# Altium project FPPZ.PrjPcb
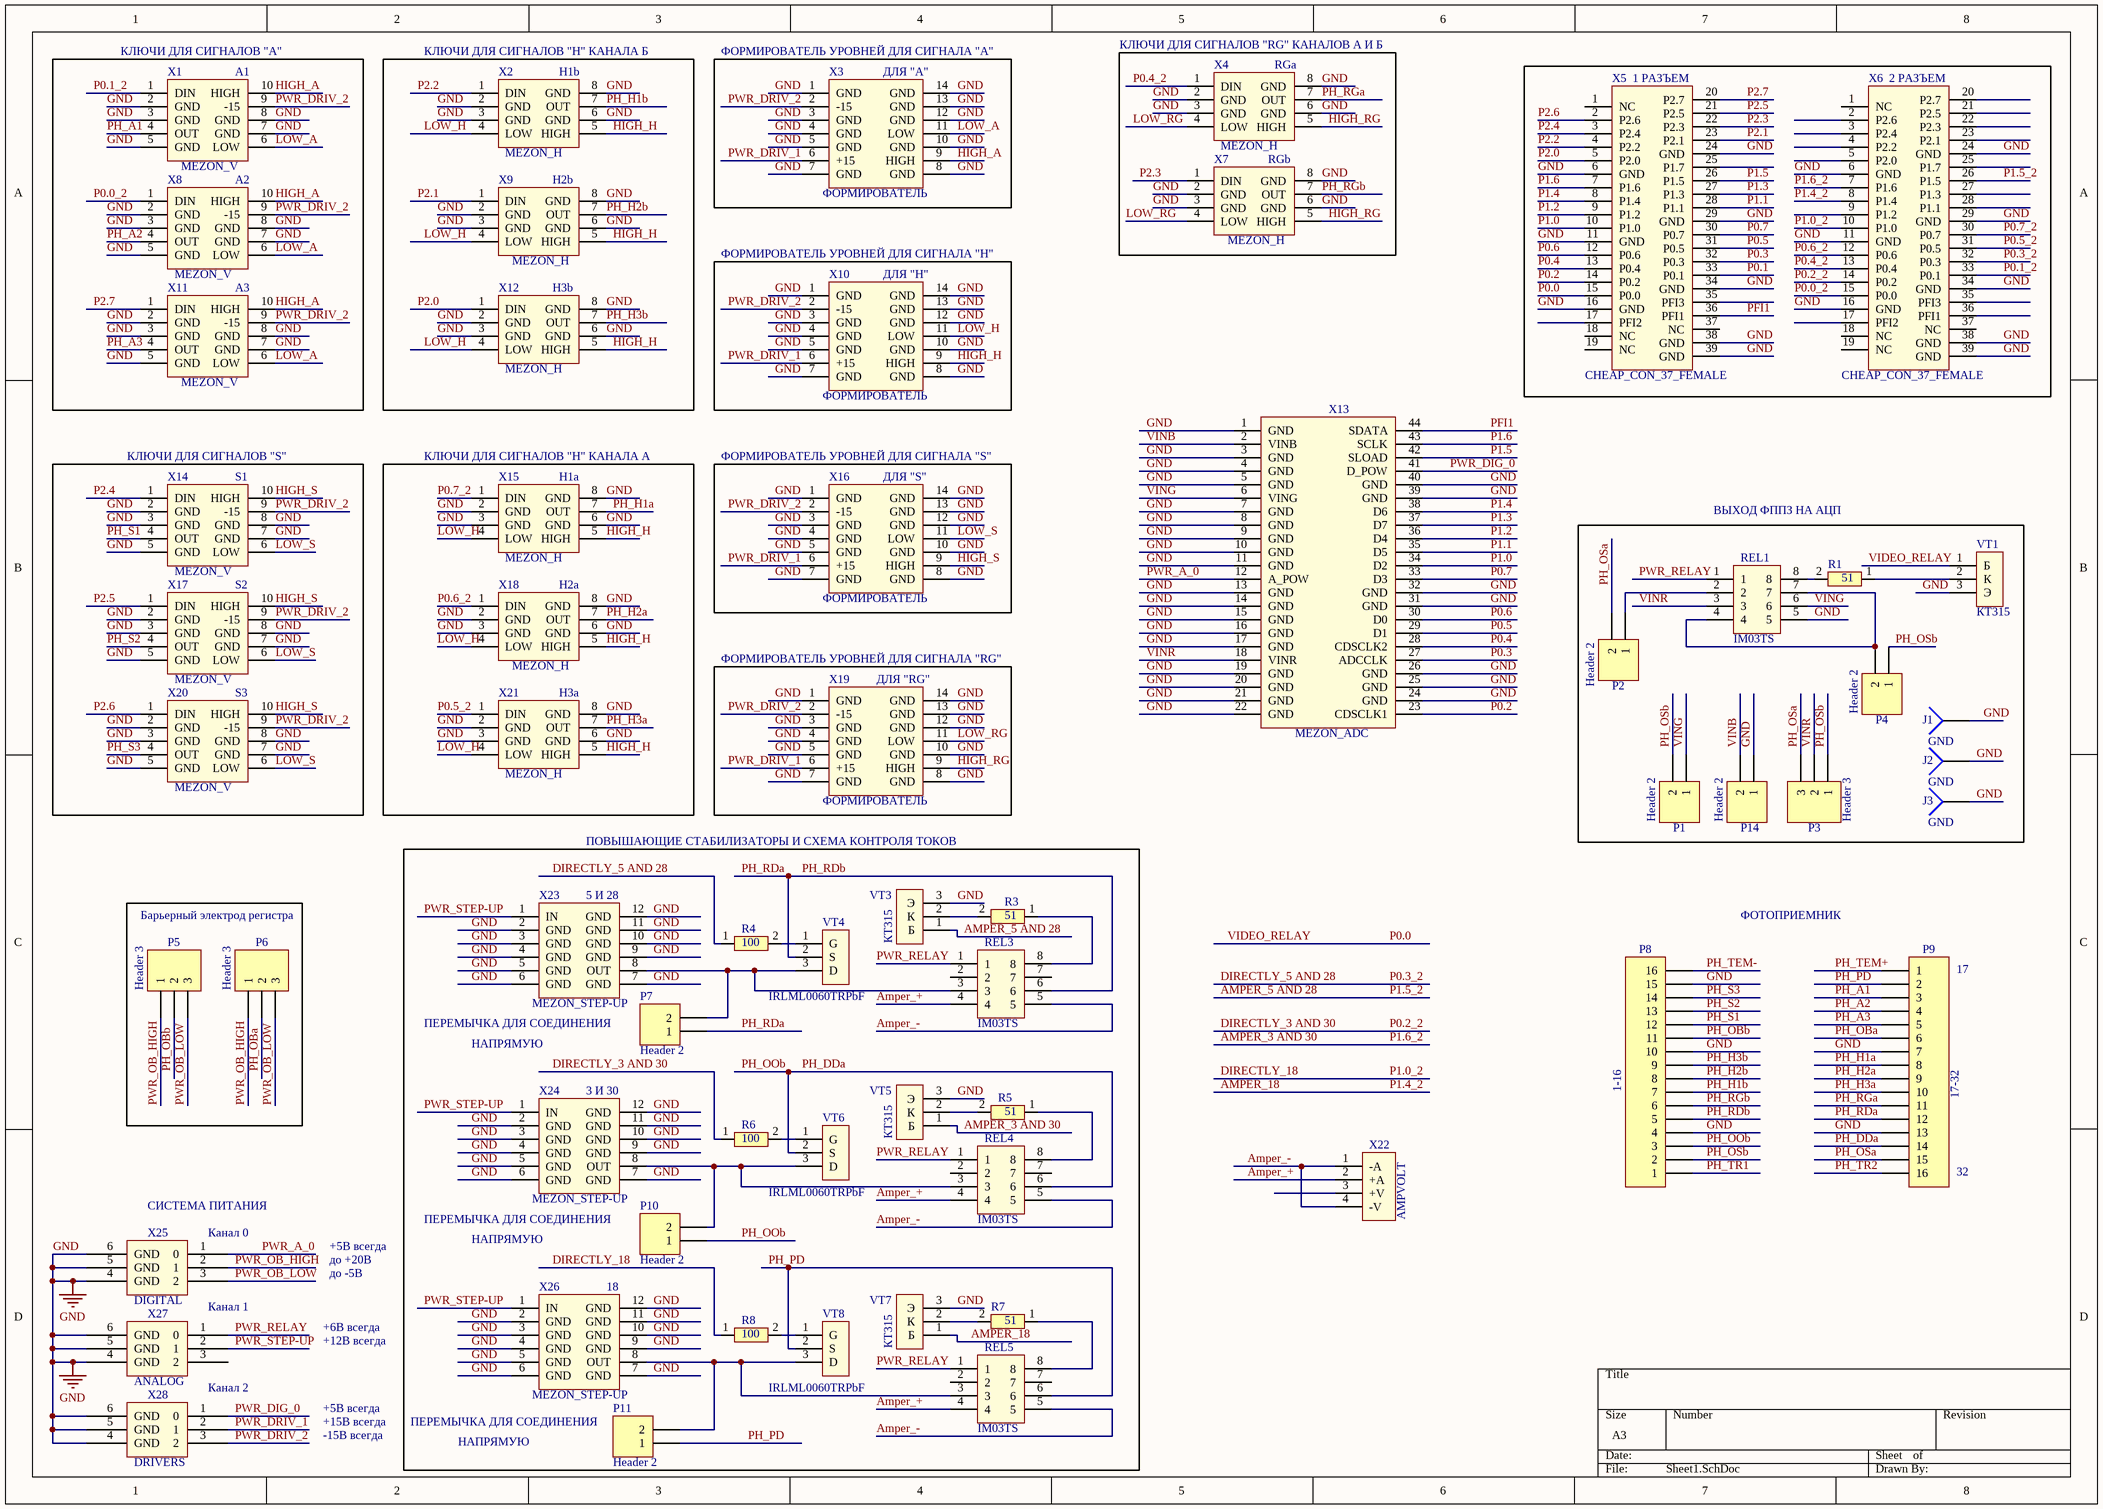
[diagram p0: Sheet1.SchDoc]
2 sheets, 64 parts. Net scope: global (net labels, ports and power ports of the same name join across sheets).
Board files: PCB.PcbDoc, ORDER_1.PcbDoc, ORDER_2.PcbDoc
Sheets:
  Sheet1.SchDoc
  outdoor_plata.SchDoc

## Sheet Sheet1.SchDoc: ФППЗУ Э3
size A3; DrawnBy: Лукашин; Engineer: Лукашин; Organization: ЭНПО "СПЭЛС"; Revision: 1; SheetNumber: 1; ProjectName: ФППЗ

### Parts
J1  GND  [PIN1]
J2  GND  [PIN1]
J3  GND  [PIN1]
P1  Header 2  [HDR1X2]
P2  Header 2  [HDR1X2]
P3  Header 3  [HDR1X3]
P4  Header 2  [HDR1X2]
P5  Header 3  [HDR1X3]
P6  Header 3  [HDR1X3]
P7  Header 2  [HDR1X2]
P8  1-16  [HDR1X16]
P9  17-32  [HDR1X16]
P10  Header 2  [HDR1X2]
P11  Header 2  [HDR1X2]
P14  Header 2  [HDR1X2]
R1  51  [RES]
R3  51  [RES]
R4  100  [RES]
R5  51  [RES]
R6  100  [RES]
R7  51  [RES]
R8  100  [RES]
REL1  IM03TS  [IM03TS]
REL3  IM03TS  [IM03TS]
REL4  IM03TS  [IM03TS]
REL5  IM03TS  [IM03TS]
VT1  КТ315  [KT315]
VT3  КТ315  [KT315]
VT4  IRLML0060TRPbF  [SOT23-BEC_MMBT3640*(Primary)]
VT5  КТ315  [KT315]
VT6  IRLML0060TRPbF  [SOT23-BEC_MMBT3640*(Primary)]
VT7  КТ315  [KT315]
VT8  IRLML0060TRPbF  [SOT23-BEC_MMBT3640*(Primary)]
X1  MEZON_V  [MEZON_V]
X2  MEZON_H  [MEZON_H]
X3  ФОРМИРОВАТЕЛЬ  [MEZON_V+H]
X4  MEZON_H  [MEZON_H]
X5  CHEAP_CON_37_FEMALE  [CHEAP_CONN_FEMALE]
X6  CHEAP_CON_37_FEMALE  [CHEAP_CONN_FEMALE]
X7  MEZON_H  [MEZON_H]
X8  MEZON_V  [MEZON_V]
X9  MEZON_H  [MEZON_H]
X10  ФОРМИРОВАТЕЛЬ  [MEZON_V+H]
X11  MEZON_V  [MEZON_V]
X12  MEZON_H  [MEZON_H]
X13  MEZON_ADC  [MEZON_ADC]
X14  MEZON_V  [MEZON_V]
X15  MEZON_H  [MEZON_H]
X16  ФОРМИРОВАТЕЛЬ  [MEZON_V+H]
X17  MEZON_V  [MEZON_V]
X18  MEZON_H  [MEZON_H]
X19  ФОРМИРОВАТЕЛЬ  [MEZON_V+H]
X20  MEZON_V  [MEZON_V]
X21  MEZON_H  [MEZON_H]
X22  AMPVOLT  [AMP_VOLTMETER]
X23  MEZON_STEP-UP  [MEZON_STEP-UP]
X24  MEZON_STEP-UP  [MEZON_STEP-UP]
X25  DIGITAL  [POWER]
X26  MEZON_STEP-UP  [MEZON_STEP-UP]
X27  ANALOG  [POWER]
X28  DRIVERS  [POWER]

### Blocks framed on the sheet
ВЫХОД ФППЗ НА АЦП: J1-J3 P1-P4 P14 R1 REL1 VT1
Барьерный электрод регистра: P5 P6

### Nets
GND: J1.1 J2.1 J3.1 P8.4 P8.10 P8.15 P9.7 P9.13 P14.1 REL1.5 VT1.3(Э) VT3.3(Э) VT5.3(Э) VT7.3(Э) X1.2(GND) X1.3(GND) X1.5(GND) X1.7(GND) X1.8(GND) X2.2(GND) X2.3(GND) X2.6(GND) X2.8(GND) X3.1(GND) X3.3(GND) X3.4(GND) X3.5(GND) X3.7(GND) X3.8(GND) X3.10(GND) X3.12(GND) X3.13(GND) X3.14(GND) X4.2(GND) X4.3(GND) X4.6(GND) X4.8(GND) X5.6(GND) X5.11(GND) X5.16(GND) X5.24(GND) X5.29(GND) X5.34(GND) X5.38(GND) X5.39(GND) X6.6(GND) X6.11(GND) X6.16(GND) X6.24(GND) X6.29(GND) X6.34(GND) X6.38(GND) X6.39(GND) X7.2(GND) X7.3(GND) X7.6(GND) X7.8(GND) X8.2(GND) X8.3(GND) X8.5(GND) X8.7(GND) X8.8(GND) X9.2(GND) X9.3(GND) X9.6(GND) X9.8(GND) X10.1(GND) X10.3(GND) X10.4(GND) X10.5(GND) X10.7(GND) X10.8(GND) X10.10(GND) X10.12(GND) X10.13(GND) X10.14(GND) X11.2(GND) X11.3(GND) X11.5(GND) X11.7(GND) X11.8(GND) X12.2(GND) X12.3(GND) X12.6(GND) X12.8(GND) X13.1(GND) X13.3(GND) X13.4(GND) X13.5(GND) X13.7(GND) X13.8(GND) X13.9(GND) X13.10(GND) X13.11(GND) X13.13(GND) X13.14(GND) X13.15(GND) X13.16(GND) X13.17(GND) X13.19(GND) X13.20(GND) X13.21(GND) X13.22(GND) X13.24(GND) X13.25(GND) X13.26(GND) X13.31(GND) X13.32(GND) X13.39(GND) X13.40(GND) X14.2(GND) X14.3(GND) X14.5(GND) X14.7(GND) X14.8(GND) X15.2(GND) X15.3(GND) X15.6(GND) X15.8(GND) X16.1(GND) X16.3(GND) X16.4(GND) X16.5(GND) X16.7(GND) X16.8(GND) X16.10(GND) X16.12(GND) X16.13(GND) X16.14(GND) X17.2(GND) X17.3(GND) X17.5(GND) X17.7(GND) X17.8(GND) X18.2(GND) X18.3(GND) X18.6(GND) X18.8(GND) X19.1(GND) X19.3(GND) X19.4(GND) X19.5(GND) X19.7(GND) X19.8(GND) X19.10(GND) X19.12(GND) X19.13(GND) X19.14(GND) X20.2(GND) X20.3(GND) X20.5(GND) X20.7(GND) X20.8(GND) X21.2(GND) X21.3(GND) X21.6(GND) X21.8(GND) X23.2(GND) X23.3(GND) X23.4(GND) X23.5(GND) X23.6(GND) X23.7(GND) X23.9(GND) X23.10(GND) X23.11(GND) X23.12(GND) X24.2(GND) X24.3(GND) X24.4(GND) X24.5(GND) X24.6(GND) X24.7(GND) X24.9(GND) X24.10(GND) X24.11(GND) X24.12(GND) X25.4(GND) X25.5(GND) X25.6(GND) X26.2(GND) X26.3(GND) X26.4(GND) X26.5(GND) X26.6(GND) X26.7(GND) X26.9(GND) X26.10(GND) X26.11(GND) X26.12(GND) X27.4(GND) X27.5(GND) X27.6(GND) X28.4(GND) X28.5(GND) X28.6(GND)
AMPER_3 AND 30: VT5.1(Б) X6.7(P1.6)  [also labelled P1.6_2]
AMPER_5 AND 28: VT3.1(Б) X6.26(P1.5)  [also labelled P1.5_2]
AMPER_18: VT7.1(Б) X6.8(P1.4)  [also labelled P1.4_2]
Amper_+: REL3.4 REL4.4 REL5.4 X22.2(+A)
Amper_-: REL3.5 REL4.5 REL5.5 X22.1(-A) X22.4(-V)
DIRECTLY_3 AND 30: R6.1 X6.14(P0.2)  [also labelled P0.2_2]
DIRECTLY_5 AND 28: R4.1 X6.32(P0.3)  [also labelled P0.3_2]
DIRECTLY_18: R8.1 X6.10(P1.0)  [also labelled P1.0_2]
HIGH_A: X1.10(HIGH) X3.9(HIGH) X8.10(HIGH) X11.10(HIGH)
HIGH_H: X2.5(HIGH) X9.5(HIGH) X10.9(HIGH) X12.5(HIGH) X15.5(HIGH) X18.5(HIGH) X21.5(HIGH)
HIGH_RG: X4.5(HIGH) X7.5(HIGH) X19.9(HIGH)
HIGH_S: X14.10(HIGH) X16.9(HIGH) X17.10(HIGH) X20.10(HIGH)
LOW_A: X1.6(LOW) X3.11(LOW) X8.6(LOW) X11.6(LOW)
LOW_H: X2.4(LOW) X9.4(LOW) X10.11(LOW) X12.4(LOW) X15.4(LOW) X18.4(LOW) X21.4(LOW)
LOW_RG: X4.4(LOW) X7.4(LOW) X19.11(LOW)
LOW_S: X14.6(LOW) X16.11(LOW) X17.6(LOW) X20.6(LOW)
P0.0: VT1.1(Б) X5.15(P0.0)  [also labelled VIDEO_RELAY]
P0.0_2: X6.15(P0.0) X8.1(DIN)
P0.1: X5.33(P0.1)
P0.1_2: X1.1(DIN) X6.33(P0.1)
P0.2: X5.14(P0.2) X13.23(CDSCLK1)
P0.3: X5.32(P0.3) X13.27(ADCCLK)
P0.4: X5.13(P0.4) X13.28(CDSCLK2)
P0.4_2: X4.1(DIN) X6.13(P0.4)
P0.5: X5.31(P0.5) X13.29(D1)
P0.5_2: X6.31(P0.5) X21.1(DIN)
P0.6: X5.12(P0.6) X13.30(D0)
P0.6_2: X6.12(P0.6) X18.1(DIN)
P0.7: X5.30(P0.7) X13.33(D3)
P0.7_2: X6.30(P0.7) X15.1(DIN)
P1.0: X5.10(P1.0) X13.34(D2)
P1.1: X5.28(P1.1) X13.35(D5)
P1.2: X5.9(P1.2) X13.36(D4)
P1.3: X5.27(P1.3) X13.37(D7)
P1.4: X5.8(P1.4) X13.38(D6)
P1.5: X5.26(P1.5) X13.42(SLOAD)
P1.6: X5.7(P1.6) X13.43(SCLK)
P2.0: X5.5(P2.0) X12.1(DIN)
P2.1: X5.23(P2.1) X9.1(DIN)
P2.2: X2.1(DIN) X5.4(P2.2)
P2.3: X5.22(P2.3) X7.1(DIN)
P2.4: X5.3(P2.4) X14.1(DIN)
P2.5: X5.21(P2.5) X17.1(DIN)
P2.6: X5.2(P2.6) X20.1(DIN)
P2.7: X5.20(P2.7) X11.1(DIN)
PFI1: X5.36(PFI1) X13.44(SDATA)
PH_A1: P9.3 X1.4(OUT)
PH_A2: P9.4 X8.4(OUT)
PH_A3: P9.5 X11.4(OUT)
PH_DDa: P8.3 P9.14 P10.1 REL4.6 VT6.2(S)  [also labelled PH_OOb]
PH_H1a: P9.8 X15.7(OUT)
PH_H1b: P8.7 X2.7(OUT)
PH_H2a: P9.9 X18.7(OUT)
PH_H2b: P8.8 X9.7(OUT)
PH_H3a: P9.10 X21.7(OUT)
PH_H3b: P8.9 X12.7(OUT)
PH_OBa: P6.2 P9.6
PH_OBb: P5.2 P8.11
PH_OSa: P2.2 P3.3 P9.15
PH_OSb: P1.2 P3.1 P4.1 P8.2
PH_PD: P9.2 P11.1 REL5.6 VT8.2(S)
PH_RDa: P7.1 P8.5 P9.12 REL3.6 VT4.2(S)  [also labelled PH_RDb]
PH_RGa: P9.11 X4.7(OUT)
PH_RGb: P8.6 X7.7(OUT)
PH_S1: P8.12 X14.4(OUT)
PH_S2: P8.13 X17.4(OUT)
PH_S3: P8.14 X20.4(OUT)
PH_TEM+: P9.1
PH_TEM-: P8.16
PH_TR1: P8.1
PH_TR2: P9.16
PWR_A_0: X13.12(A_POW) X25.1(0)
PWR_DIG_0: X13.41(D_POW) X28.1(0)
PWR_DRIV_1: X3.6(+15) X10.6(+15) X16.6(+15) X19.6(+15) X28.2(1)
PWR_DRIV_2: X1.9(-15) X3.2(-15) X8.9(-15) X10.2(-15) X11.9(-15) X14.9(-15) X16.2(-15) X17.9(-15) X19.2(-15) X20.9(-15) X28.3(2)
PWR_OB_HIGH: P5.1 P6.1 X25.2(1)
PWR_OB_LOW: P5.3 P6.3 X25.3(2)
PWR_RELAY: REL1.1 REL3.1 REL4.1 REL5.1 X27.1(0)
PWR_STEP-UP: X23.1(IN) X24.1(IN) X26.1(IN) X27.2(1)
VINB: P14.2 X13.2(VINB)
VING: P1.1 REL1.6 X13.6(VING)
VINR: P3.2 REL1.3 X13.18(VINR)
NetP2_1: P2.1 REL1.2
NetP4_2: P4.2 REL1.4 REL1.7
NetP7_2: P7.2 REL3.3 VT4.3(D) X23.8(OUT)
NetP10_2: P10.2 REL4.3 VT6.3(D) X24.8(OUT)
NetP11_2: P11.2 REL5.3 VT8.3(D) X26.8(OUT)
NetR1_1: R1.1 VT1.2(К)
NetR1_2: R1.2 REL1.8
NetR3_1: R3.1 REL3.8
NetR3_2: R3.2 VT3.2(К)
NetR4_2: R4.2 VT4.1(G)
NetR5_1: R5.1 REL4.8
NetR5_2: R5.2 VT5.2(К)
NetR6_2: R6.2 VT6.1(G)
NetR7_1: R7.1 REL5.8
NetR7_2: R7.2 VT7.2(К)
NetR8_2: R8.2 VT8.1(G)

Not connected (* = marked no-connect by the designer): REL3 2 7; REL4 2 7; REL5 2 7; X5 1(NC) 17(PFI2) 18(NC) 19(NC) 25(P1.7) 35(PFI3) 37(NC); X6 1(NC) 2(P2.6) 3(P2.4) 4(P2.2) 5(P2.0) 9(P1.2) 17(PFI2) 18(NC) 19(NC) 20(P2.7) 21(P2.5) 22(P2.3) 23(P2.1) 25(P1.7) 27(P1.3) 28(P1.1) 35(PFI3) 36(PFI1) 37(NC); X22 3(+V); X27 3(2)

### Notes on the sheet
- (near X4) КЛЮЧИ ДЛЯ СИГНАЛОВ "RG" КАНАЛОВ А И Б
- (near X1) КЛЮЧИ ДЛЯ СИГНАЛОВ "А"
- (near X1) A1
- (near X2) КЛЮЧИ ДЛЯ СИГНАЛОВ "H" КАНАЛА Б
- (near X2) H1b
- (near X3) ФОРМИРОВАТЕЛЬ УРОВНЕЙ ДЛЯ СИГНАЛА "A"
- (near X3) ДЛЯ "A"
- (near X4) RGa
- (near X5) 1 РАЗЪЕМ
- (near X6) 2 РАЗЪЕМ
- (near X8) A2
- (near X9) H2b
- (near X7) RGb
- (near X11) A3
- (near X12) H3b
- (near X10) ФОРМИРОВАТЕЛЬ УРОВНЕЙ ДЛЯ СИГНАЛА "H"
- (near X10) ДЛЯ "Н"
- (near X14) КЛЮЧИ ДЛЯ СИГНАЛОВ "S"
- (near X14) S1
- (near X15) КЛЮЧИ ДЛЯ СИГНАЛОВ "H" КАНАЛА А
- (near X15) H1a
- (near X16) ФОРМИРОВАТЕЛЬ УРОВНЕЙ ДЛЯ СИГНАЛА "S"
- (near X16) ДЛЯ "S"
- (near X17) S2
- (near X18) H2a
- (near X20) S3
- (near X21) H3a
- (near X19) ФОРМИРОВАТЕЛЬ УРОВНЕЙ ДЛЯ СИГНАЛА "RG"
- (near X19) ДЛЯ "RG"
- ПОВЫШАЮЩИЕ СТАБИЛИЗАТОРЫ И СХЕМА КОНТРОЛЯ ТОКОВ
- (near X23) 5 И 28
- ФОТОПРИЕМНИК
- (near P9) 17
- (near X23) ПЕРЕМЫЧКА ДЛЯ СОЕДИНЕНИЯ
- НАПРЯМУЮ
- (near X24) 3 И 30
- (near P9) 32
- (near X25) СИСТЕМА ПИТАНИЯ
- (near X25) Канал 0
- до +20В
- +5В всегда
- (near X24) ПЕРЕМЫЧКА ДЛЯ СОЕДИНЕНИЯ
- Канал 1
- до -5В
- (near X26) 18
- Канал 2
- +12В всегда
- +6В всегда
- -15В всегда
- +15В всегда
- (near X26) ПЕРЕМЫЧКА ДЛЯ СОЕДИНЕНИЯ

### Library data of the parts
J1-J3 = Socket: LatestRevisionDate: 17-Jul-2002; LatestRevisionNote: Re-released for DXP Platform.; Publisher: Altium Limited
P1 P2 P4 P7 P10 P11 P14 = Header 2: Header, 2-Pin; LatestRevisionDate: 17-Jul-2002; LatestRevisionNote: Re-released for DXP Platform.; Publisher: Altium Limited
P3 P5 P6 = Header 3: Header, 3-Pin; LatestRevisionDate: 17-Jul-2002; LatestRevisionNote: Re-released for DXP Platform.; Publisher: Altium Limited
P8 P9 = Header 16: Header, 16-Pin; LatestRevisionDate: 17-Jul-2002; LatestRevisionNote: Re-released for DXP Platform.; Publisher: Altium Limited
R1 R3-R8 = RES
X3 X10 X16 X19 = MEZON_V+H
X22 = AMP_VOLTMETER
X25 X27 X28 = POWER

## Sheet outdoor_plata.SchDoc
size A4
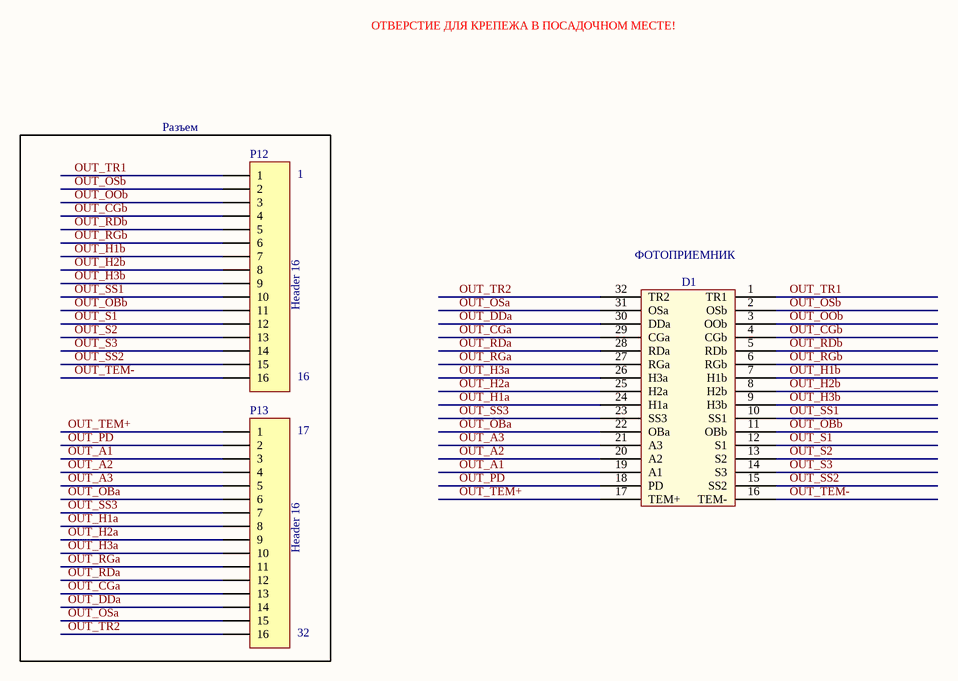
[diagram p1: outdoor_plata.SchDoc]

### Parts
D1  FPPZ 1024M  [FPPZ_1024M]  (value not drawn)
P12  Header 16  [HDR1X16]
P13  Header 16  [HDR1X16]

### Nets
OUT_A1: D1.19(A1) P13.3
OUT_A2: D1.20(A2) P13.4
OUT_A3: D1.21(A3) P13.5
OUT_CGa: D1.29(CGa) P13.13
OUT_CGb: D1.4(CGb) P12.4
OUT_DDa: D1.30(DDa) P13.14
OUT_H1a: D1.24(H1a) P13.8
OUT_H1b: D1.7(H1b) P12.7
OUT_H2a: D1.25(H2a) P13.9
OUT_H2b: D1.8(H2b) P12.8
OUT_H3a: D1.26(H3a) P13.10
OUT_H3b: D1.9(H3b) P12.9
OUT_OBa: D1.22(OBa) P13.6
OUT_OBb: D1.11(OBb) P12.11
OUT_OOb: D1.3(OOb) P12.3
OUT_OSa: D1.31(OSa) P13.15
OUT_OSb: D1.2(OSb) P12.2
OUT_PD: D1.18(PD) P13.2
OUT_RDa: D1.28(RDa) P13.12
OUT_RDb: D1.5(RDb) P12.5
OUT_RGa: D1.27(RGa) P13.11
OUT_RGb: D1.6(RGb) P12.6
OUT_S1: D1.12(S1) P12.12
OUT_S2: D1.13(S2) P12.13
OUT_S3: D1.14(S3) P12.14
OUT_SS1: D1.10(SS1) P12.10
OUT_SS2: D1.15(SS2) P12.15
OUT_SS3: D1.23(SS3) P13.7
OUT_TEM+: D1.17(TEM+) P13.1
OUT_TEM-: D1.16(TEM-) P12.16
OUT_TR1: D1.1(TR1) P12.1
OUT_TR2: D1.32(TR2) P13.16

### Notes on the sheet
- ОТВЕРСТИЕ ДЛЯ КРЕПЕЖА В ПОСАДОЧНОМ МЕСТЕ!
- Разъем
- (near P12) 1
- (near D1) ФОТОПРИЕМНИК
- 16
- 17
- (near P13) 32

### Library data of the parts
P12 P13 = Header 16: Header, 16-Pin; LatestRevisionDate: 17-Jul-2002; LatestRevisionNote: Re-released for DXP Platform.; Publisher: Altium Limited